# EAGLE design Power Supply (EAGLE 7.5.0)
Power Supply : convert 9V input voltage to a high output voltage
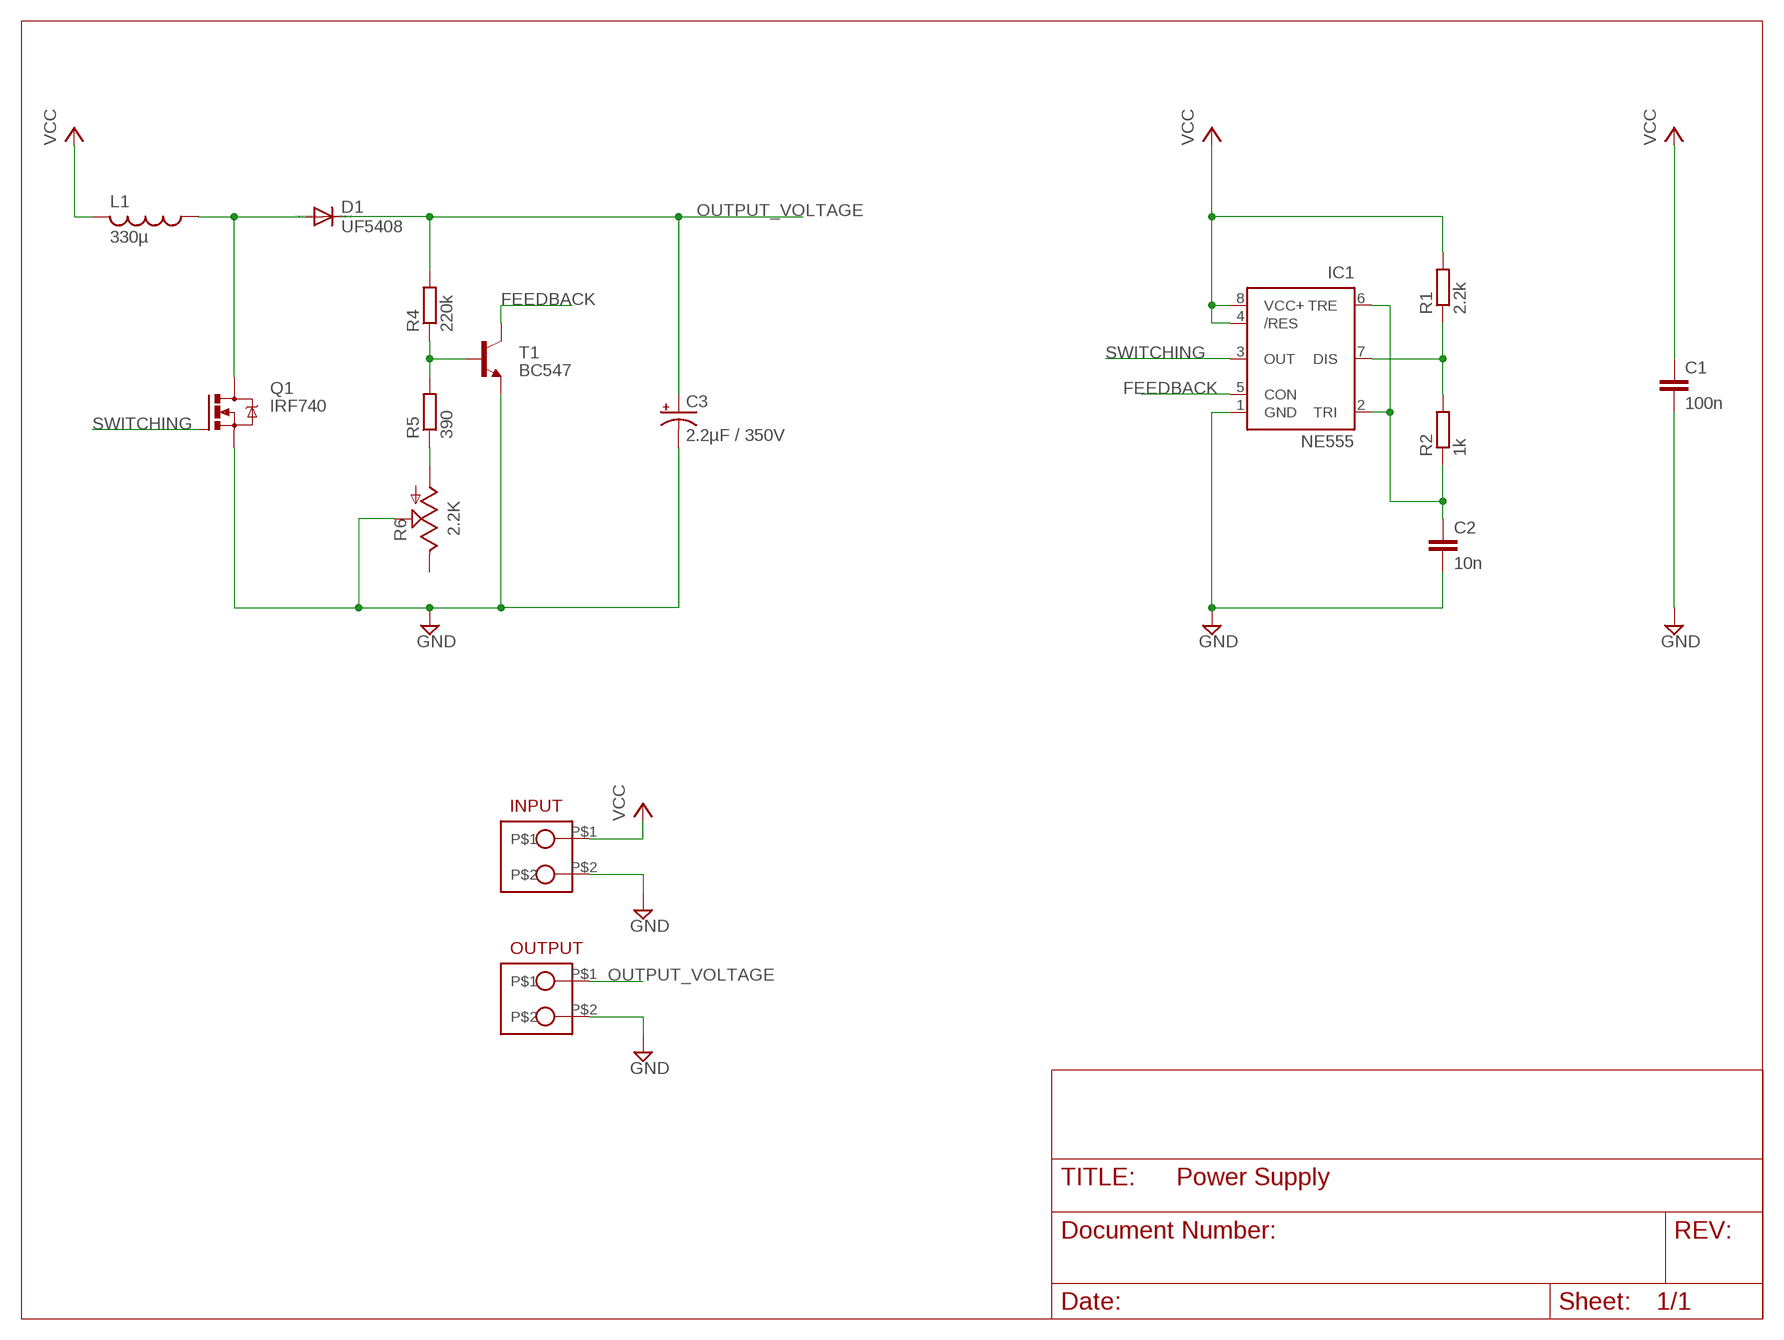
[diagram p0: schematic, sheet 1]

## Parts
C1  100n  C-EU050-030X075  [C050-030X075]
C2  10n  C-EU050-030X075  [C050-030X075]
C3  2.2µF / 350V  CPOL-USTAP5-80  [TAP5-80]
D1  UF5408  UF5400  [DO201-15]
IC1  NE555  [DIL-08]
INPUT  CON_2_SIL  [SIL_2_0.2INCH]
L1  330µ  L-US6000-XXX-RC  [6000-XXXX-RC]
OUTPUT  CON_2_SIL  [SIL_2_0.2INCH]
Q1  IRF740  [TO220BV]
R1  2.2k  R-EU_0207/10  [0207/10]
R2  1k  R-EU_0207/10  [0207/10]
R4  220k  R-EU_0207/10  [0207/10]
R5  390  R-EU_0207/10  [0207/10]
R6  2.2K  TRIM_US-CA9V  [CA9V]
T1  BC547  [TO92]

## Nets
FEEDBACK: IC1.5(CON) T1.3(C)
GND: C1.2 C2.2 C3.- IC1.1(GND) INPUT.P$2 OUTPUT.P$2 Q1.S R6.S T1.1(E)
N$2: D1.A L1.1 Q1.D
N$3: IC1.7(DIS) R1.1 R2.2
N$4: R5.1 R6.A
N$5: R4.1 R5.2 T1.2(B)
N$6: C2.1 IC1.2(TRI) IC1.6(TRE) R2.1
OUTPUT_VOLTAGE: C3.+ D1.C OUTPUT.P$1 R4.2
SWITCHING: IC1.3(OUT) Q1.G
VCC: C1.1 IC1.4(/RES) IC1.8(VCC+) INPUT.P$1 L1.2 R1.2
Unconnected: R6.E

## Library data of the parts
C1 C2 = rcl:C-EU: CAPACITOR, European symbol
C3 = rcl:CPOL-US: POLARIZED CAPACITOR, American symbol
D1 = diode:UF5400: DIODE ultra fast rectifier, 3 A
IC1 = st-microelectronics:NE555: General purpose bipolar Timer; MF: Arrow Electronics; MPN: NE555N; OC_FARNELL: 1467742; OC_NEWARK: 89K1486
INPUT OUTPUT = PGT:CON_2_SIL: Connecteur à 2 pattes, avec un écart de 0.2 inc (soit 5.08 mm).
L1 = rcl:L-US: INDUCTOR, American symbol
Q1 = transistor-power:IRF740: N-CHANNEL MOS FET
R1 R2 R4 R5 = resistor:R-EU_: RESISTOR, European symbol
R6 = pot:TRIM_US-: POTENTIOMETER
T1 = transistor:BC547: NPN TRANSISTOR

## Board
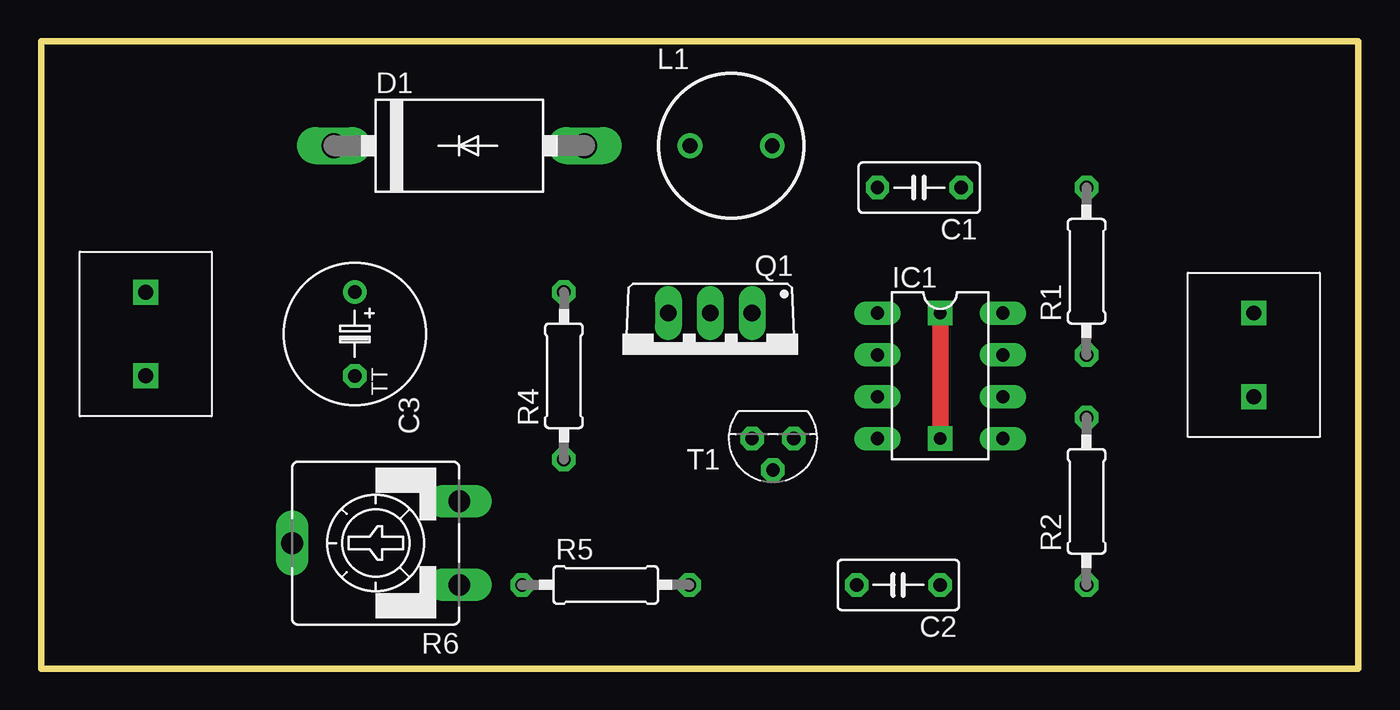
[diagram p1: board, top side]
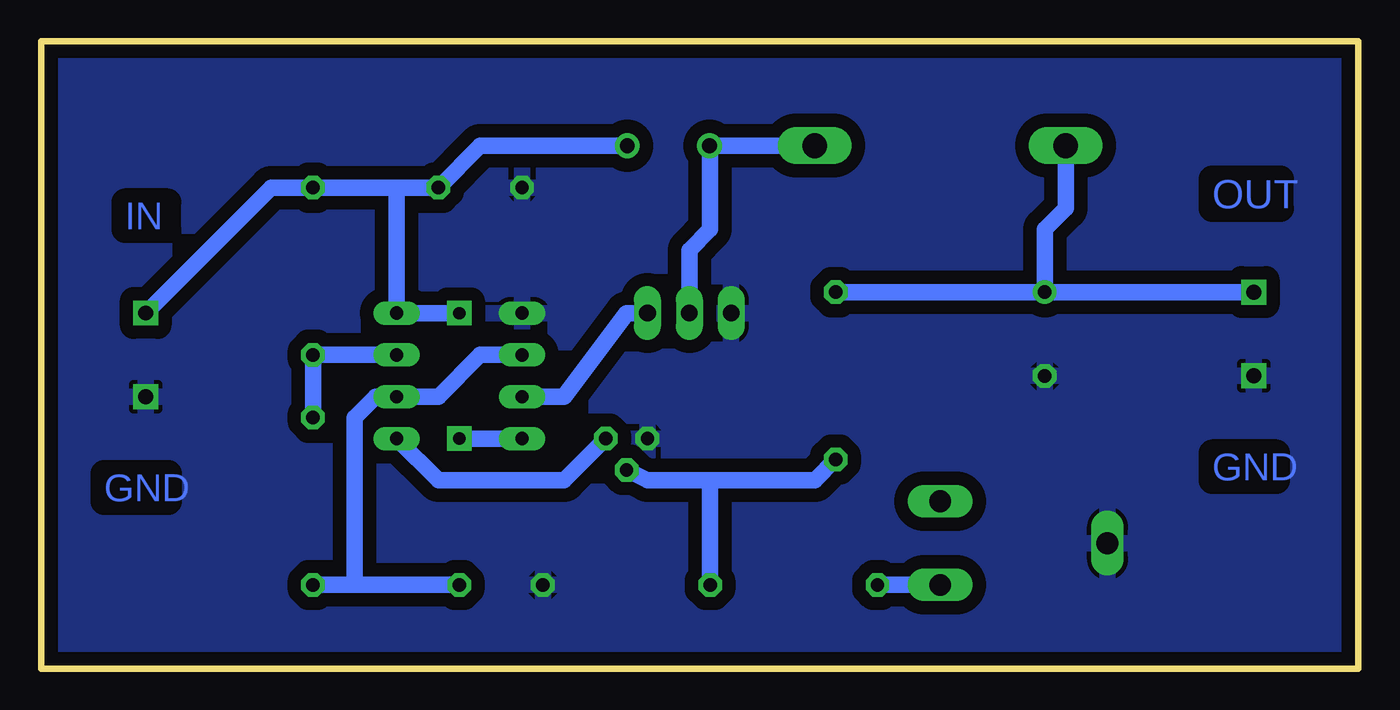
[diagram p2: board, bottom side, seen from below]

Size 80.01 x 38.1 mm. Coordinates in mm from the lower left corner, seen from the top.
Outline: 0,0 80.01,0 80.01,38.1 0,38.1 0,0
Copper layers (1*16): Top 0.035mm / dielectric 1.5mm / Bottom 0.035mm
Design rules "SparkFun *": minimum track width 8mil, minimum drill 20mil, track to track 8mil, track to pad 8mil, pad to pad 8mil, via to via 8mil, smd to smd 8mil, copper to edge 8mil, drill to drill 8mil, minimum pad ring 12mil, minimum via ring 10mil, stop-mask expansion 4mil, vias tented up to drill 20mil, thermal gap 10mil

### Footprints (pad centres in the part's own frame; a part is rotated, then mirrored left to right if it is on the bottom)
C050-030X075 = drill 0.813 octagon: 1 -2.54,0; 2 2.54,0
TAP5-80 = drill 0.813: + -2.54,0 | drill 0.813 octagon: - 2.54,0
DO201-15 = drill 1.499 long: A 7.62,0; C -7.62,0
DIL-08 = drill 0.813 long: 1 -3.81,-3.81; 2 -1.27,-3.81; 3 1.27,-3.81; 4 3.81,-3.81; 5 3.81,3.81; 6 1.27,3.81; 7 -1.27,3.81; 8 -3.81,3.81
SIL_2_0.2INCH = drill 0.9 square: P$1 0,2.54; P$2 0,-2.54
6000-XXXX-RC = drill 0.9 pad 1.422: 1 -2.5,0; 2 2.5,0
TO220BV = drill 1.016 long: D 0,-2.54; G -2.54,-2.54; S 2.54,-2.54
0207/10 = drill 0.813 octagon: 1 -5.08,0; 2 5.08,0
CA9V = drill 1.321 long: A -2.54,-5.08; E 2.54,-5.08; S 0,5.08
TO92 = drill 0.813 octagon: 1 1.27,0; 2 0,1.905; 3 -1.27,0

### Placement (x,y rotation side)
C1  53.34,29.21 180 top
C2  52.07,5.08 180 top
C3  19.05,20.32 270 top
D1  25.4,31.75 0 top
IC1  54.61,17.78 270 top
INPUT  73.66,19.05 0 top
L1  41.91,31.75 0 top
OUTPUT  6.35,20.32 0 top
Q1  40.64,19.05 180 top
R1  63.5,24.13 90 top
R2  63.5,10.16 90 top
R4  31.75,17.78 90 top
R5  34.29,5.08 0 top
R6  20.32,7.62 90 top
T1  44.45,13.97 180 top

### Tracks (layer width: path | path; a pad name or v marks a point on that pad's centre or on a via)
FEEDBACK
  Bottom 1.016: T1.3 48.26,11.43 55.88,11.43 IC1.5
GND
  pour Bottom (isolate 0.813): 1.27,36.83 78.74,36.83 78.74,1.27 1.27,1.27
N$2
  Bottom 1.016: D1.A L1.1 39.37,31.75 39.37,26.67 40.64,25.4 Q1.D
N$3
  Bottom 1.016: R2.2 R1.1 IC1.7
N$4
  Bottom 1.016: R6.A R5.1
N$5
  Bottom 1.016: R4.1 33.02,11.43 39.37,11.43 | 39.37,11.43 43.18,11.43 T1.2 | R5.2 39.37,11.43
N$6
  Bottom 1.016: R2.1 60.96,5.08 | 60.96,5.08 C2.1 | IC1.2 53.34,19.05 55.88,16.51 IC1.6 59.69,16.51 60.96,15.24 60.96,5.08
OUTPUT_VOLTAGE
  Bottom 1.016: C3.+ R4.2 | D1.C 17.78,27.94 19.05,26.67 C3.+ | OUTPUT.P$1 C3.+
SWITCHING
  Bottom 1.016: IC1.3 48.26,16.51 44.45,21.59 Q1.G
VCC  (via drill 0.74)
  Top 1.016: v54.61,13.97 v54.61,21.59
  Bottom 1.016: L1.2 53.34,31.75 C1.1 58.42,29.21 | 58.42,29.21 IC1.8 v54.61,21.59 | 58.42,29.21 R1.2 66.04,29.21 INPUT.P$1 | IC1.4 v54.61,13.97

### Text on the board
Bottom: OUT | IN | GND | GND